# Altium schematic sheet Sheet3.SchDoc
size A
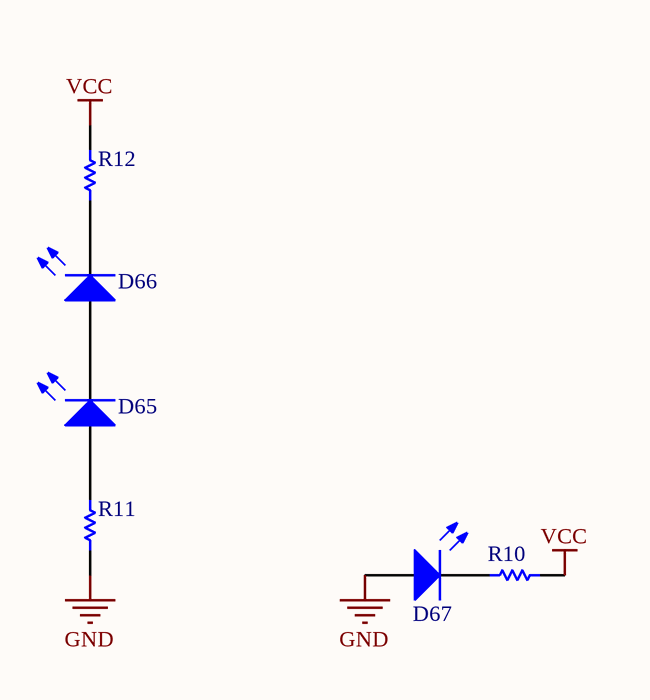
[diagram p0: Sheet3.SchDoc]

## Parts
D65  LED 3mm  [LED-3mm]  (value not drawn)
D66  LED 3mm  [LED-3mm]  (value not drawn)
D67  LED 3mm  [LED-3mm]  (value not drawn)
R10  Resistor vertical  [Res50]  (value not drawn)
R11  Resistor vertical  [Res50]  (value not drawn)
R12  Resistor vertical  [Res50]  (value not drawn)

## Nets
GND: D67.1(A) R11.1
VCC: R10.2 R12.2
NetD65_1: D65.1(A) R11.2
NetD65_2: D65.2(K) D66.1(A)
NetD66_2: D66.2(K) R12.1

Not connected (* = marked no-connect by the designer): D67 2(K); R10 1

## Library data of the parts
D65-D67 = LED 3mm: Typical LED; Designer: Seyed Mohsen Ghasemian; Published: 02/04/2012; PackageReference: LED; Publisher: www.picpars.com; PackageDescription: LED; 2 Leads
R10-R12 = Resistor vertical: Resistor 0.5; Publisher: Seyed mohsen ghasemian; WEB: www.picpars.com